# Altium schematic sheet ALU_Desgn.SchDoc
size A3; SheetNumber: 4; SheetTotal: 9
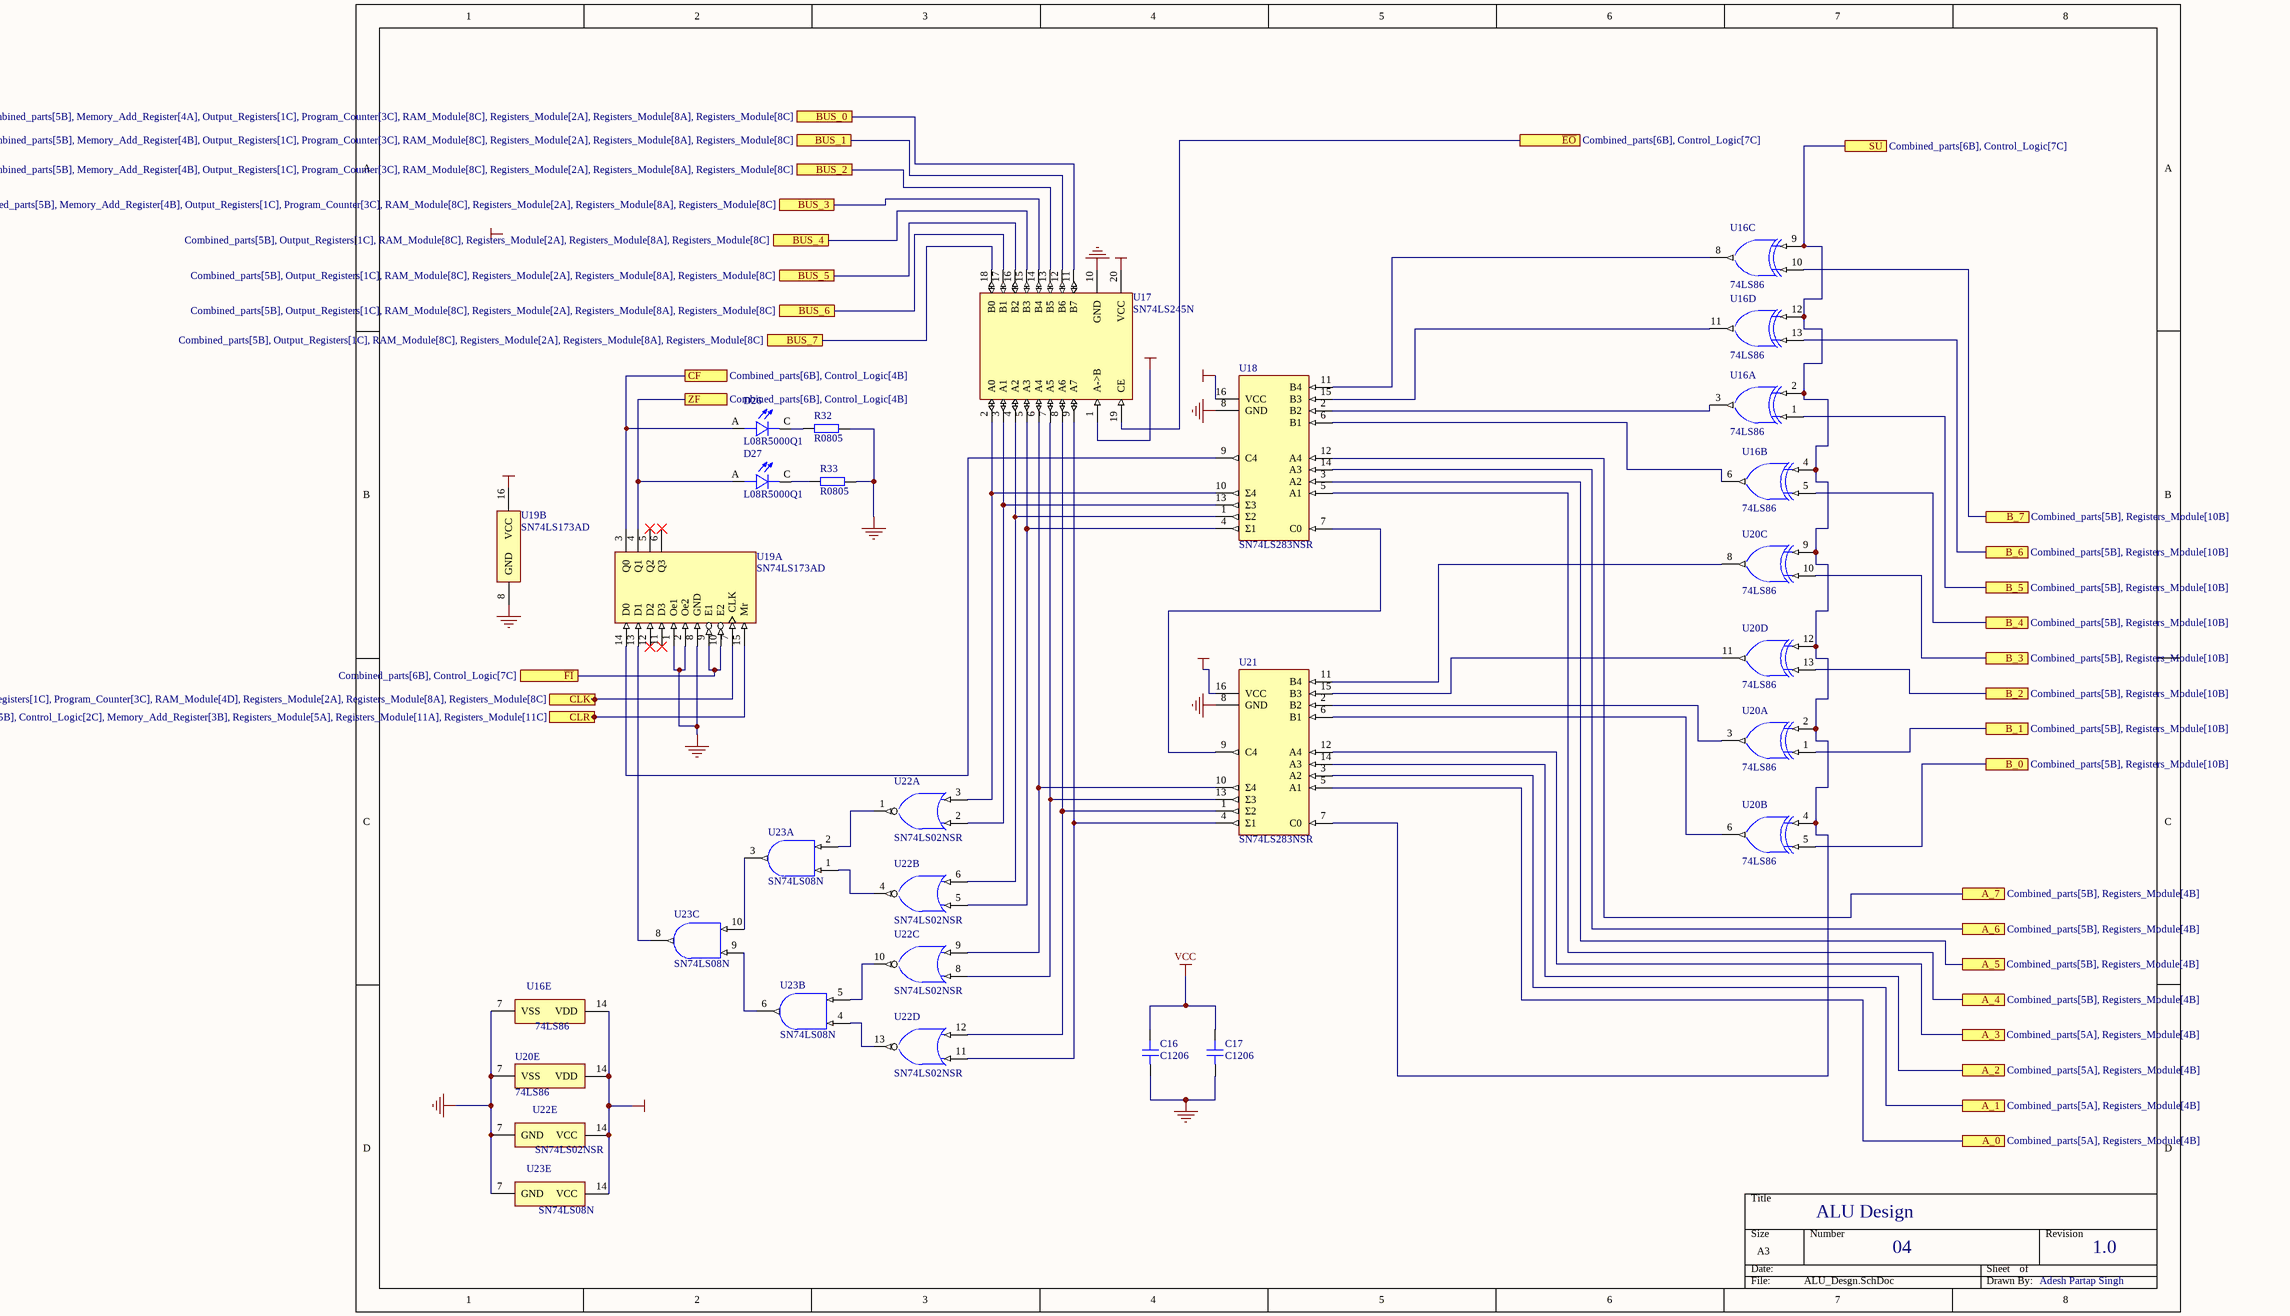
[diagram p0: ALU_Desgn.SchDoc]

## Parts
C16  C1206  [CAP_1206]
C17  C1206  [CAP_1206]
D26  L08R5000Q1  [LEDRD254W57D500H1070]
D27  L08R5000Q1  [LEDRD254W57D500H1070]
R32  R0805  [RES_0805]
R33  R0805  [RES_0805]
U16  74LS86  [D14]  (parts A,B,C,D,E of 5)
U17  SN74LS245N  [FP-N0020A-MFG]
U18  SN74LS283NSR  [NS0016A_L]
U19  SN74LS173AD  [D0016A_N]  (parts A,B of 2)
U20  74LS86  [D14]  (parts A,B,C,D,E of 5)
U21  SN74LS283NSR  [NS0016A_L]
U22  SN74LS02NSR  [NS0014A_M]  (parts A,B,C,D,E of 5)
U23  SN74LS08N  [N0014A]  (parts A,B,C,E of 5)

## Ports
A_0 (see Combined_parts[5A], Registers_Module[4B]), A_1 (see Combined_parts[5A], Registers_Module[4B]), A_2 (see Combined_parts[5A], Registers_Module[4B]), A_3 (see Combined_parts[5A], Registers_Module[4B]), A_4 (see Combined_parts[5B], Registers_Module[4B]), A_5 (see Combined_parts[5B], Registers_Module[4B]), A_6 (see Combined_parts[5B], Registers_Module[4B]), A_7 (see Combined_parts[5B], Registers_Module[4B]), B_0 (see Combined_parts[5B], Registers_Module[10B]), B_1 (see Combined_parts[5B], Registers_Module[10B]), B_2 (see Combined_parts[5B], Registers_Module[10B]), B_3 (see Combined_parts[5B], Registers_Module[10B]), B_4 (see Combined_parts[5B], Registers_Module[10B]), B_5 (see Combined_parts[5B], Registers_Module[10B]), B_6 (see Combined_parts[5B], Registers_Module[10B]), B_7 (see Combined_parts[5B], Registers_Module[10B]), BUS_0 (see Combined_parts[5B], Memory_Add_Register[4A], Output_Registers[1C], Program_Counter[3C], RAM_Module[8C], Registers_Module[2A], Registers_Module[8A], Registers_Module[8C]), BUS_1 (see Combined_parts[5B], Memory_Add_Register[4B], Output_Registers[1C], Program_Counter[3C], RAM_Module[8C], Registers_Module[2A], Registers_Module[8A], Registers_Module[8C]), BUS_2 (see Combined_parts[5B], Memory_Add_Register[4B], Output_Registers[1C], Program_Counter[3C], RAM_Module[8C], Registers_Module[2A], Registers_Module[8A], Registers_Module[8C]), BUS_3 (see Combined_parts[5B], Memory_Add_Register[4B], Output_Registers[1C], Program_Counter[3C], RAM_Module[8C], Registers_Module[2A], Registers_Module[8A], Registers_Module[8C]), BUS_4 (see Combined_parts[5B], Output_Registers[1C], RAM_Module[8C], Registers_Module[2A], Registers_Module[8A], Registers_Module[8C]), BUS_5 (see Combined_parts[5B], Output_Registers[1C], RAM_Module[8C], Registers_Module[2A], Registers_Module[8A], Registers_Module[8C]), BUS_6 (see Combined_parts[5B], Output_Registers[1C], RAM_Module[8C], Registers_Module[2A], Registers_Module[8A], Registers_Module[8C]), BUS_7 (see Combined_parts[5B], Output_Registers[1C], RAM_Module[8C], Registers_Module[2A], Registers_Module[8A], Registers_Module[8C]), CF (see Combined_parts[6B], Control_Logic[4B]), CLK (see Combined_parts[5B], Clock_module[4C], Memory_Add_Register[3B], Output_Registers[1C], Program_Counter[3C], RAM_Module[4D], Registers_Module[2A], Registers_Module[8A], Registers_Module[8C]), CLR (see Combined_parts[5B], Control_Logic[2C], Memory_Add_Register[3B], Registers_Module[5A], Registers_Module[11A], Registers_Module[11C]), SU (see Combined_parts[6B], Control_Logic[7C]), ZF (see Combined_parts[6B], Control_Logic[4B]), ~{EO} (see Combined_parts[6B], Control_Logic[7C]), ~{FI} (see Combined_parts[6B], Control_Logic[7C])

## Nets
GND: C16.1 C17.1 R32.2 R33.2 U16.7(VSS) U17.10(GND) U18.8(GND) U19.1(Oe1) U19.2(Oe2) U19.8(GND) U20.7(VSS) U21.8(GND) U22.7(GND) U23.7(GND)
VCC: C16.2 C17.2 U16.14(VDD) U17.1(A->B) U17.20(VCC) U18.16(VCC) U19.16(VCC) U20.14(VDD) U21.16(VCC) U22.14(VCC) U23.14(VCC)
A_0: U21.5(A1) ; port A_0
A_1: U21.3(A2) ; port A_1
A_2: U21.14(A3) ; port A_2
A_3: U21.12(A4) ; port A_3
A_4: U18.5(A1) ; port A_4
A_5: U18.3(A2) ; port A_5
A_6: U18.14(A3) ; port A_6
A_7: U18.12(A4) ; port A_7
B_0: U20.5(C) ; port B_0
B_1: U20.1(A) ; port B_1
B_2: U20.13(G) ; port B_2
B_3: U20.10(E) ; port B_3
B_4: U16.5(C) ; port B_4
B_5: U16.1(A) ; port B_5
B_6: U16.13(G) ; port B_6
B_7: U16.10(E) ; port B_7
BUS_0: U17.11(B7) ; port BUS_0
BUS_1: U17.12(B6) ; port BUS_1
BUS_2: U17.13(B5) ; port BUS_2
BUS_3: U17.14(B4) ; port BUS_3
BUS_4: U17.15(B3) ; port BUS_4
BUS_5: U17.16(B2) ; port BUS_5
BUS_6: U17.17(B1) ; port BUS_6
BUS_7: U17.18(B0) ; port BUS_7
CF: D26.A U19.3(Q0) ; port CF
CLK: U19.7(CLK) ; port CLK
CLR: U19.15(Mr) ; port CLR
~{EO}: U17.19(CE) ; port ~{EO}
~{FI}: U19.9(E1) U19.10(E2) ; port ~{FI}
SU: U16.2(B) U16.4(D) U16.9(F) U16.12(H) U20.2(B) U20.4(D) U20.9(F) U20.12(H) U21.7(C0) ; port SU
ZF: D27.A U19.4(Q1) ; port ZF
NetD26_C: D26.C R32.1
NetD27_C: D27.C R33.1
NetU16_3: U16.3(J) U18.2(B2)
NetU16_6: U16.6(K) U18.6(B1)
NetU16_8: U16.8(L) U18.11(B4)
NetU16_11: U16.11(M) U18.15(B3)
NetU17_2: U17.2(A0) U18.10(Σ4) U22.3(1B)
NetU17_3: U17.3(A1) U18.13(Σ3) U22.2(1A)
NetU17_4: U17.4(A2) U18.1(Σ2) U22.6(2B)
NetU17_5: U17.5(A3) U18.4(Σ1) U22.5(2A)
NetU17_6: U17.6(A4) U21.10(Σ4) U22.9(3B)
NetU17_7: U17.7(A5) U21.13(Σ3) U22.8(3A)
NetU17_8: U17.8(A6) U21.1(Σ2) U22.12(4B)
NetU17_9: U17.9(A7) U21.4(Σ1) U22.11(4A)
NetU18_7: U18.7(C0) U21.9(C4)
NetU18_9: U18.9(C4) U19.14(D0)
NetU19_13: U19.13(D1) U23.8(3Y)
NetU20_3: U20.3(J) U21.2(B2)
NetU20_6: U20.6(K) U21.6(B1)
NetU20_8: U20.8(L) U21.11(B4)
NetU20_11: U20.11(M) U21.15(B3)
NetU22_1: U22.1(1Y) U23.2(1B)
NetU22_4: U22.4(2Y) U23.1(1A)
NetU22_10: U22.10(3Y) U23.5(2B)
NetU22_13: U22.13(4Y) U23.4(2A)
NetU23_3: U23.3(1Y) U23.10(3B)
NetU23_6: U23.6(2Y) U23.9(3A)

Not connected (* = marked no-connect by the designer): U19 5(Q2)* 6(Q3)* 11(D3)* 12(D2)*

## Notes on the sheet
- ALU Design
- 04
- 1.0
- Adesh Partap Singh
- Labels drawn without touching a wire or pin: VCC

## Library data of the parts
C16 C17 = CAP_1206: Capacitor SMD 1206; Manufacturer: *; Manufacturer Part Number: *; Distributor Link: *; LCSC: *; Rating: *; Dielectric: *
D26 D27 = L08R5000Q1: LED, 5MM, ORANGE; LED / Lamp Size: 5mm / T-1 3/4; LED Colour: Orange; Typ Luminous Intensity: 4.3mcd; Viewing Angle: ...; MF: LED Technology; Value: *; SnapEDA_Link: https://www.snapeda.com/parts/L08R5000Q1/LED+Technology/view-part/?ref=snap; MP: L08R5000Q1; Check_prices: https://www.snapeda.com/parts/L08R5000Q1/LED+Technology/view-part/?ref=eda; Availability: In Stock; Price: None; Package: None
R32 R33 = RES_0805: Resistor SMD 0805; Manufacturer: *; Manufacturer Part Number: *; Distributor Link: *; LCSC: *
U16 U20 = 74LS86: XOR (Exclusive OR) IC 4 Channel 14-PDIP; Manufacturer: Texas Instruments; Generic Part Number: CD4030B; Technology Family: 74LS; Schmitt Trigger: No; VCC(Min)(V): 3; Input Type: CMOS; Rating: Military; Voltage(Nom)(V): 10; tpd @ Nom Voltage(Max)(ns): 130; VCC(Max)(V): 18; F @ Nom Voltage(Max)(Mhz): 8; Bits(#): 4; Output Drive (IOL/IOH)(Max)(mA): 1.5/-1.5; ICC @ Nom Voltage(Max)(mA): 0.015; Operating Temperature Range(C): -55 to 125; DatasheetVersion: SCHS035C; PackageReference: N0014A; Output Type: CMOS
U17 = CMP-1620-00419-3: IC TXRX NON-INVERT 5.25V 20DIP; Number of Bits per Element: 8; Polarity: Non-Inverting; Low Level Output Current: 24mA; Propagation Delay: 12ns; Min Supply Voltage: 4.75V; Number of Elements: 1; Quiescent Current: 62mA; Logic Function: Transceiver; Direction: Bidirectional; Operating Supply Voltage: 5V; High Level Output Current: -15mA; Mount: Through Hole; Min Operating Temperature: 0°C; Number of Outputs: 8; Max Operating Temperature: 70°C; Max Supply Voltage: 5.25V; Width: 6.35mm; Number of Pins: 20; RoHS Compliant: Yes; Turn-On Delay Time: 12ns; Termination: Through Hole; Number of Channels: 8; Number of Circuits: 8; Weight: 0.042297oz; Package Quantity: 20; Number of Transceivers: 8; Length: 24.33mm; Height: 4.57mm; REACH SVHC: No SVHC; Contact Plating: Gold; Number of Bits: 8; Lead Free: Lead Free; Case/Package: PDIP; Packaging: Rail/Tube; Radiation Hardening: No
U18 U21 = CMP-1623-00603-2: 4-Bit Binary Full Adders With Fast Carry, NS0016A, LARGE T&R; Manufacturer: Texas Instruments; Technology Family: LS; Function: Arithmetic; VCC(Min)(V): 4.75; VCC(Max)(V): 5.25; F @ Nom Voltage(Max)(Mhz): 35; tpd @ Nom Voltage(Max)(ns): 24; Output Type: CMOS; Input Type: TTL; Rating: Catalog; Inputs: 9; Output Drive (IOL/IOH)(Max)(mA): 8/-0.4; ICC @ Nom Voltage(Max)(mA): 34; Schmitt Trigger: No; Voltage(Nom)(V): 5; Bits(#): 4; PackageReference: NS0016A; DatasheetVersion: SDLS095A; Generic Part Number: SN74LS283; Type: Binary; Operating Temperature Range(C): 0 to 70
U19 = CMP-1616-00008-3: 4-Bit D-type Registers with 3-State Outputs, D0016A, TUBE; Manufacturer: Texas Instruments; Output Logic: Non-inverted; F @ Nom Voltage(Max)(Mhz): 35; VCC(Max)(V): 5.25; VCC(Min)(V): 4.75; tpd @ Nom Voltage(Max)(ns): 30; 3-State Output: Yes; ICC @ Nom Voltage(Max)(mA): 24; Voltage(Nom)(V): 5; Output Type: TTL; Rating: Catalog; Bits(#): 4; Output: 3S; Technology Family: LS; Schmitt Trigger: No; Output Drive (IOL/IOH)(Max)(mA): 24/-2.6; PackageReference: D0016A; Generic Part Number: SN74LS173A; Input Type: TTL; Operating Temperature Range(C): 0 to 70; DatasheetVersion: SDLS067A; Code_JEDEC: MS-012 variation AC
U22 = CMP-0806-00215-4: Quad 2-input positive-NOR gates, NS0014A, LARGE T&R; Manufacturer: Texas Instruments; Voltage(Nom)(V): 5; VCC(Min)(V): 4.75; tpd @ Nom Voltage(Max)(ns): 22; Output Drive (IOL/IOH)(Max)(mA): 0.4/-8; F @ Nom Voltage(Max)(Mhz): 35; ICC @ Nom Voltage(Max)(mA): 0.027; Output Type: TTL; Bits(#): 4; VCC(Max)(V): 5.25; Rating: Catalog; DatasheetVersion: SDLS027; PackageReference: NS0014A; Generic Part Number: SN74LS02; PackageVersion: http://www.ti.com/lit/ml/msop002a/msop002a.pdf; Operating Temperature Range(C): 0 to 70; Input Type: TTL
U23 = CMP-0777-00259-3: Quadruple 2-Input Positive-AND Gates, N0014A, TUBE; Manufacturer: Texas Instruments; VCC(Max)(V): 5.25; ICC @ Nom Voltage(Max)(mA): 0.021; VCC(Min)(V): 4.75; tpd @ Nom Voltage(Max)(ns): 25; Rating: Catalog; Output Type: TTL; Bits(#): 4; Schmitt Trigger: No; Voltage(Nom)(V): 5; Technology Family: LS; F @ Nom Voltage(Max)(Mhz): 35; Output Drive (IOL/IOH)(Max)(mA): -0.8/16; PackageReference: N0014A; DatasheetVersion: SDLS033; Input Type: TTL; Operating Temperature Range(C): 0 to 70; Generic Part Number: SN74LS08